# EAGLE design RxPCB_V1-1 (EAGLE 9.6.2)
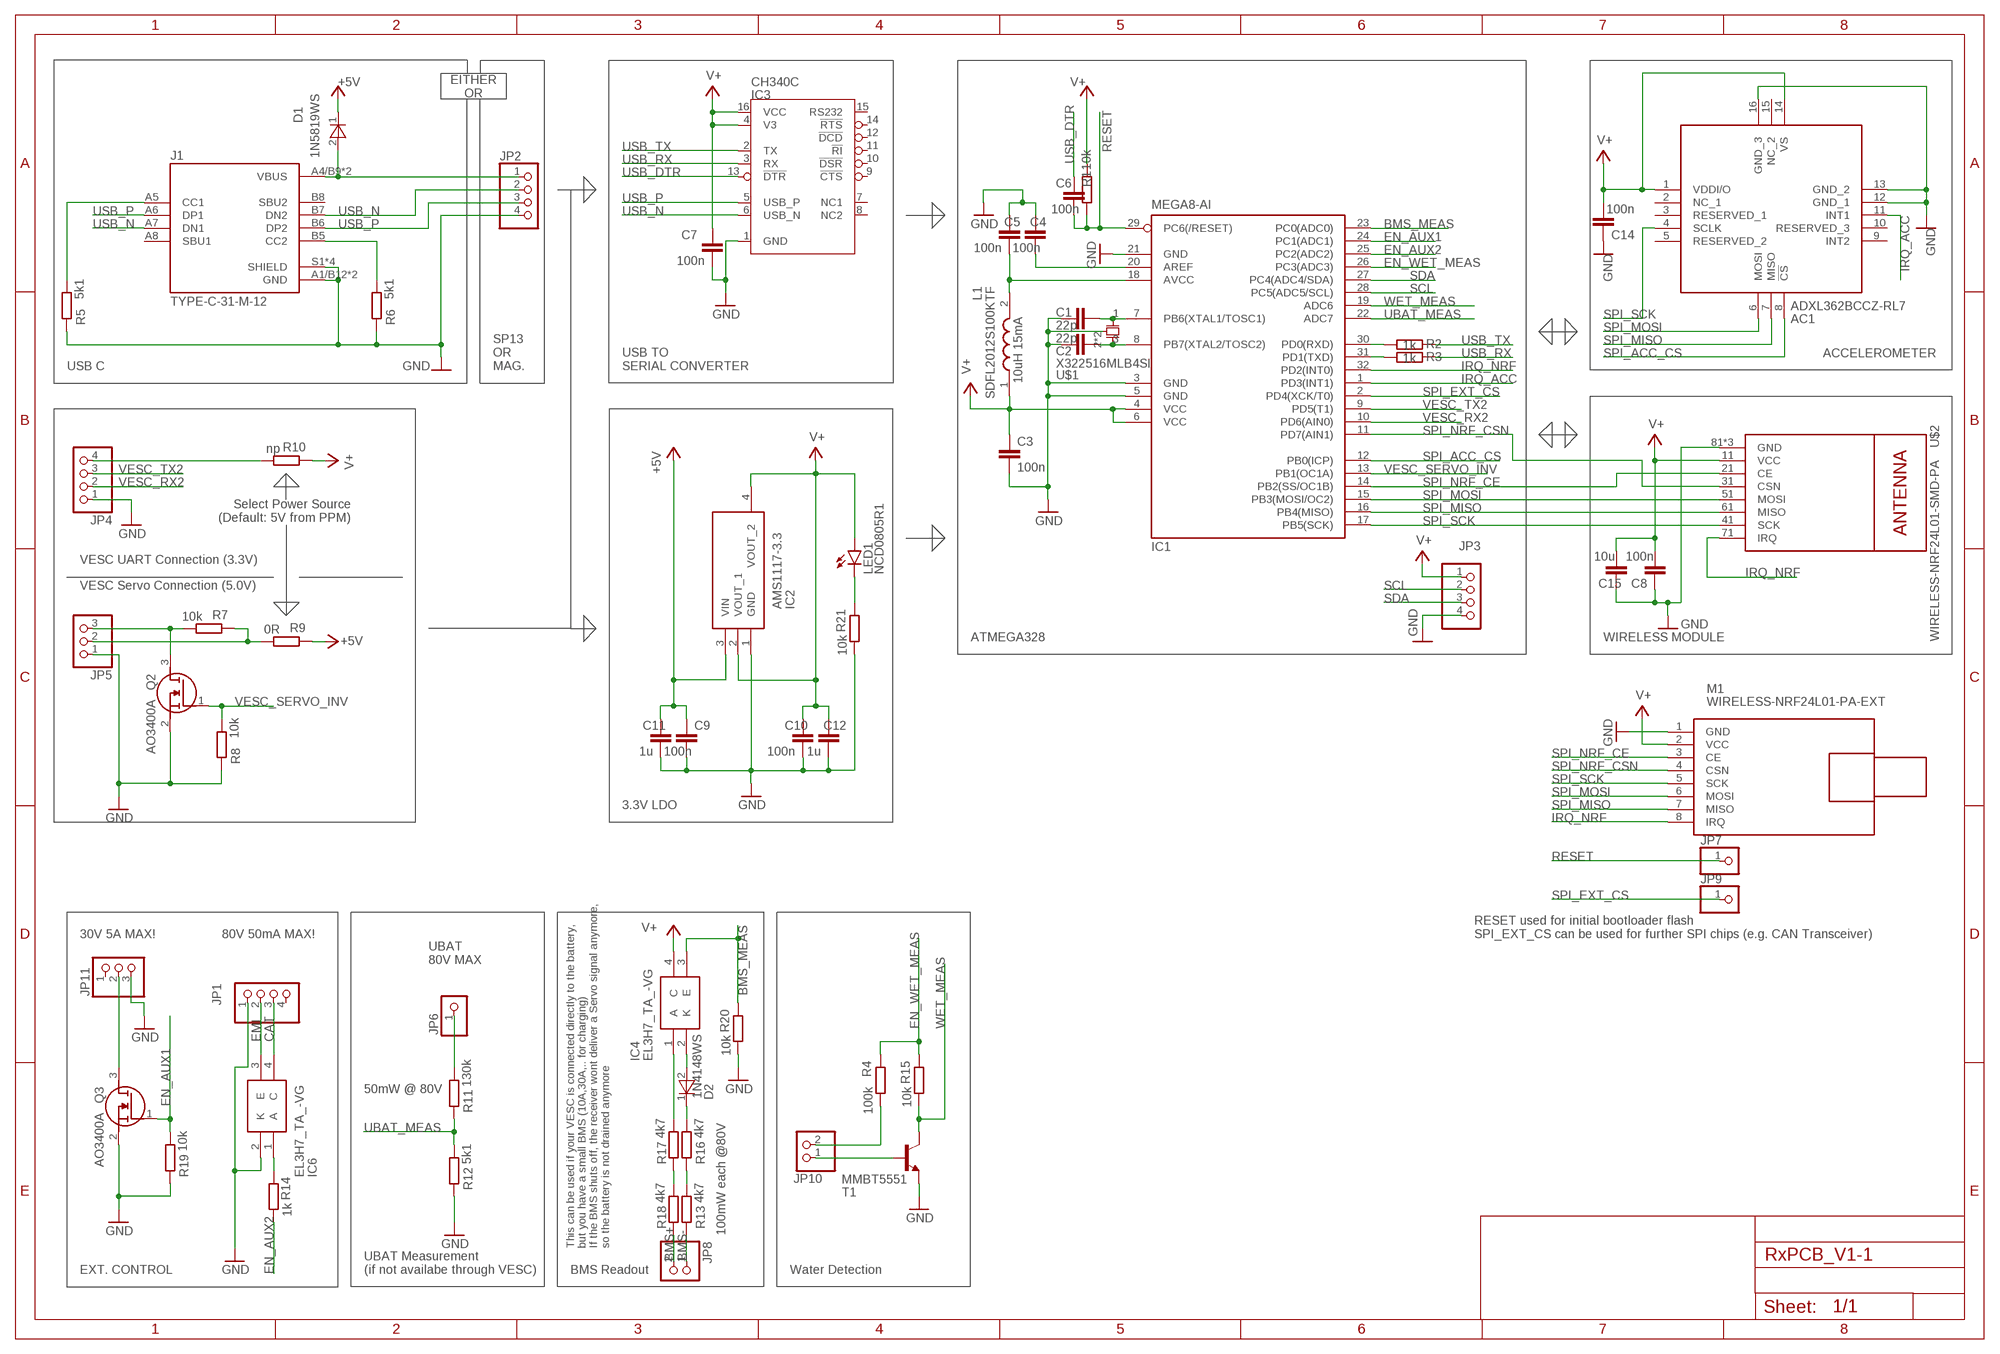
[diagram p0: schematic, sheet 1]

## Parts
AC1  ADXL362BCCZ-RL7  [CC-16-4]
C1  22p  C-EUC0603  [C0603]
C2  22p  C-EUC0603  [C0603]
C3  100n  C-EUC0603  [C0603]
C4  100n  C-EUC0603  [C0603]
C5  100n  C-EUC0603  [C0603]
C6  100n  C-EUC0603  [C0603]
C7  100n  C-EUC0603  [C0603]
C8  100n  C-EUC0603  [C0603]
C9  100n  C-EUC0603  [C0603]
C10  100n  C-EUC0603  [C0603]
C11  1u  C-EUC0603  [C0603]
C12  1u  C-EUC0603  [C0603]
C14  100n  C-EUC0603  [C0603]
C15  10u  C-EUC0603  [C0603]
D1  1N5819WS  1N4148WS  [SODFL2512X90N]
D2  1N4148WS  [SODFL2512X90N]
IC1  MEGA8-AI  [TQFP32-08]
IC2  AMS1117-3.3  [SOT229P700X180-4N]
IC3  CH340C  CH340G  [SOIC16N]
IC4  EL3H7_TA_-VG  [SOIC127P700X200-4N]
IC6  EL3H7_TA_-VG  [SOIC127P700X200-4N]
J1  TYPE-C-31-M-12  [HRO_TYPE-C-31-M-12]
JP1  PINHD-1X4  [1X04]
JP2  PINHD-1X4  [1X04]
JP3  PINHD-1X4  [1X04]
JP4  PINHD-1X4  [1X04]
JP5  PINHD-1X3  [1X03]
JP6  PINHD-1X1  [1X01]
JP7  PINHD-1X1  [1X01]
JP8  PINHD-1X2  [1X02]
JP9  PINHD-1X1  [1X01]
JP10  PINHD-1X2  [1X02]
JP11  PINHD-1X3  [1X03]
L1  SDFL2012S100KTF  SDFL2012Q2R7KTF  [INDC2112X105N]
LED1  NCD0805R1  LEDCHIP-LED0805  [CHIP-LED0805]
M1  WIRELESS-NRF24L01-PA-EXT  [WIRELESS-NRF24L01-PA-EXT]
Q2  AO3400A  [SOT95P280X125-3N]
Q3  AO3400A  [SOT95P280X125-3N]
R1  10k  R-EU_R0603  [R0603]
R2  1k  R-EU_R0603  [R0603]
R3  1k  R-EU_R0603  [R0603]
R4  100k  R-EU_R0603  [R0603]
R5  5k1  R-EU_R0603  [R0603]
R6  5k1  R-EU_R0603  [R0603]
R7  10k  R-EU_R0603  [R0603]
R8  10k  R-EU_R0603  [R0603]
R9  0R  R-EU_R0603  [R0603]
R10  np  R-EU_R0603  [R0603]
R11  130k  R-EU_R0603  [R0603]
R12  5k1  R-EU_R0603  [R0603]
R13  4k7  R-EU_R0603  [R0603]
R14  1k  R-EU_R0603  [R0603]
R15  10k  R-EU_R0603  [R0603]
R16  4k7  R-EU_R0603  [R0603]
R17  4k7  R-EU_R0603  [R0603]
R18  4k7  R-EU_R0603  [R0603]
R19  10k  R-EU_R0603  [R0603]
R20  10k  R-EU_R0603  [R0603]
R21  10k  R-EU_R0603  [R0603]
T1  MMBT5551  BC847B-NPN-SOT23-BEC  [SOT23-BEC]
U$1  X322516MLB4SI  X322516_BETTER  [X322516MLB4SI]
U$2  WIRELESS-NRF24L01-SMD-PA  [WIRELESS-NRF24L01_SMD_PA]

## Nets
+5V: C9.1 C11.1 D1.1(K) IC2.3(VIN) R9.1
BMS+: JP8.2 R18.1
BMS-: JP8.1 R13.1
BMS_MEAS: IC1.23(PC0(ADC0)) IC4.3(E) R20.1
CAT: IC6.4(C) JP1.3
EMI: IC6.3(E) JP1.2
EN_AUX1: IC1.24(PC1(ADC1)) Q3.1(G) R19.2
EN_AUX2: IC1.25(PC2(ADC2)) R14.2
EN_WET_MEAS: IC1.26(PC3(ADC3)) R4.1 R15.1
GND: AC1.12(GND_1) AC1.13(GND_2) AC1.16(GND_3) C1.2 C2.2 C3.2 C4.1 C5.1 C7.2 C8.1 C9.2 C10.2 C11.2 C12.2 C14.1 C15.2 IC1.3(GND) IC1.5(GND) IC1.21(GND) IC2.1(GND) IC3.1(GND) IC6.2(K) J1.A1/B12(GND) J1.B1/A12(GND) J1.S1(SHIELD) J1.S2(SHIELD) J1.S3(SHIELD) J1.S4(SHIELD) JP1.1 JP2.4 JP3.4 JP4.1 JP5.1 JP11.3 M1.1(GND) Q2.2(S) Q3.2(S) R5.1 R6.1 R8.1 R12.1 R19.1 R20.2 R21.2 T1.E U$1.2(G) U$1.4(G) U$2.81(GND) U$2.P1(GND) U$2.P2(GND)
IRQ_ACC: AC1.11(INT1) IC1.1(PD3(INT1))
IRQ_NRF: IC1.32(PD2(INT0)) M1.8(IRQ) U$2.71(IRQ)
N$1: C1.1 IC1.7(PB6(XTAL1/TOSC1)) U$1.1(X1)
N$2: C2.1 IC1.8(PB7(XTAL2/TOSC2)) U$1.3(X2)
N$3: C5.2 IC1.18(AVCC) L1.2
N$4: J1.A5(CC1) R5.2
N$5: IC4.1(A) R17.2
N$6: IC1.30(PD0(RXD)) R2.2
N$7: IC1.31(PD1(TXD)) R3.2
N$8: D1.2(A) J1.A4/B9(VBUS) J1.B4/A9(VBUS) JP2.1
N$9: LED1.C R21.1
N$10: J1.B5(CC2) R6.2
N$11: JP10.1 T1.B
N$12: JP4.4 R10.2
N$13: JP5.2 R7.1 R9.2
N$14: D2.1(K) R16.2
N$15: JP6.1 R11.2
N$16: D2.2(A) IC4.2(K)
N$18: JP10.2 R4.2
N$19: IC6.1(A) R14.1
N$21: R13.2 R16.1
N$23: R17.1 R18.2
N$27: C4.2 IC1.20(AREF)
N$34: JP11.2 Q3.3(D)
RESET: C6.2 IC1.29(PC6(/RESET)) JP7.1 R1.1
SCL: IC1.28(PC5(ADC5/SCL)) JP3.2
SDA: IC1.27(PC4(ADC4/SDA)) JP3.3
SPI_ACC_CS: AC1.8(!CS) IC1.12(PB0(ICP))
SPI_EXT_CS: IC1.2(PD4(XCK/T0)) JP9.1
SPI_MISO: AC1.7(MISO) IC1.16(PB4(MISO)) M1.7(MISO) U$2.61(MISO)
SPI_MOSI: AC1.6(MOSI) IC1.15(PB3(MOSI/OC2)) M1.6(MOSI) U$2.51(MOSI)
SPI_NRF_CE: IC1.14(PB2(SS/OC1B)) M1.3(CE) U$2.21(CE)
SPI_NRF_CSN: IC1.11(PD7(AIN1)) M1.4(CSN) U$2.31(CSN)
SPI_SCK: AC1.4(SCLK) IC1.17(PB5(SCK)) M1.5(SCK) U$2.41(SCK)
UBAT_MEAS: IC1.22(ADC7) R11.1 R12.2
USB_DTR: C6.1 IC3.13(!DTR)
USB_N: IC3.6(USB_N) J1.A7(DN1) J1.B7(DN2) JP2.2
USB_P: IC3.5(USB_P) J1.A6(DP1) J1.B6(DP2) JP2.3
USB_RX: IC3.3(RX) R3.1
USB_TX: IC3.2(TX) R2.1
V+: AC1.1(VDDI/O) AC1.14(VS) C3.1 C7.1 C8.2 C10.1 C12.1 C14.2 C15.1 IC1.4(VCC) IC1.6(VCC) IC2.2(VOUT_1) IC2.4(VOUT_2) IC3.4(V3) IC3.16(VCC) IC4.4(C) JP3.1 L1.1 LED1.A M1.2(VCC) R1.2 R10.1 U$2.11(VCC)
VESC_RX2: IC1.10(PD6(AIN0)) JP4.2
VESC_SERVO_5V: JP5.3 Q2.3(D) R7.2
VESC_SERVO_INV: IC1.13(PB1(OC1A)) Q2.1(G) R8.2
VESC_TX2: IC1.9(PD5(T1)) JP4.3
WET_MEAS: IC1.19(ADC6) R15.2 T1.C
Unconnected: AC1.2(NC_1) AC1.3(RESERVED_1) AC1.5(RESERVED_2) AC1.9(INT2) AC1.10(RESERVED_3) AC1.15(NC_2) IC3.7(NC1) IC3.8(NC2) IC3.9(!CTS) IC3.10(!DSR) IC3.11(!RI) IC3.12(!DCD) IC3.14(!RTS) IC3.15(RS232) J1.A8(SBU1) J1.B8(SBU2) JP1.4 JP11.1

## Notes on the sheet
- EITHER
  OR
- ACCELEROMETER
- USB C
- SP13
  OR
  MAG.
- USB TO
  SERIAL CONVERTER
- 10uH 15mA
- Select Power Source
  (Default: 5V from PPM)
- VESC UART Connection (3.3V)
- VESC Servo Connection (5.0V)
- ATMEGA328 | WIRELESS MODULE
- 3.3V LDO
- 30V 5A MAX! | 80V 50mA MAX!
- RESET used for initial bootloader flash
  SPI_EXT_CS can be used for further SPI chips (e.g. CAN Transceiver)
- UBAT
  80V MAX
- 50mW @ 80V
- 100mW each @80V
- This can be used if your VESC is connected directly to the battery,
  but you have a small BMS (10A,30A,.. for charging)
  If the BMS shuts off, the receiver wont deliver a Servo signal anymore,
  so the battery is not drained anymore
- EXT. CONTROL
- UBAT Measurement
  (if not availabe through VESC)
- BMS Readout | Water Detection

## Library data of the parts
AC1 = ADXL362BCCZ-RL7:ADXL362BCCZ-RL7: Accelerometers Micropower 3-Axis Digital Output MEMS Source: Datasheet <http://www.analog.com/media/en/technical-documentation/data-sheets/ADXL362.pdf>; ARROW_PART_NUMBER: ADXL362BCCZ-RL7; ARROW_PRICE-STOCK: https://www.arrow.com/en/products/adxl362bccz-rl7/analog-devices?region=nac; DESCRIPTION: Accelerometers Micropower 3-Axis Digital Output MEMS; HEIGHT: mm; MANUFACTURER_NAME: Analog Devices; MANUFACTURER_PART_NUMBER: ADXL362BCCZ-RL7; MOUSER_PART_NUMBER: 584-ADXL362BCCZ-R7; MOUSER_PRICE-STOCK: https://www.mouser.co.uk/ProductDetail/Analog-Devices/ADXL362BCCZ-RL7?qs=WIvQP4zGanhCOhEEyirq5Q%3D%3D
C1-C12 C14 C15 = rcl:C-EU: CAPACITOR, European symbol; SPICEPREFIX: C
D1 D2 = 1N4148WS:1N4148WS: ON Semiconductor Switching Diode, 300mA 75V, 2-Pin SOD-323 1N4148WS Source: Datasheet; ARROW_PART_NUMBER: 1N4148WS; ARROW_PRICE-STOCK: https://www.arrow.com/en/products/1n4148ws/on-semiconductor?region=nac; DESCRIPTION: ON Semiconductor Switching Diode, 300mA 75V, 2-Pin SOD-323 1N4148WS; HEIGHT: 0.9mm; MANUFACTURER_NAME: onsemi; MANUFACTURER_PART_NUMBER: 1N4148WS; MOUSER_PART_NUMBER: 512-1N4148WS; MOUSER_PRICE-STOCK: https://www.mouser.co.uk/ProductDetail/ON-Semiconductor-Fairchild/1N4148WS?qs=2%2FYqgE%252BHg%252BKBrKZlAsMLhw%3D%3D
IC1 = atmel:MEGA8: MICROCONTROLLER 8 Kbytes FLASH, 1 kbytes SRAM, 512 bytes EEPROM, USART, 6-channel 10 bit ADC, 2-channel 8 bit ADC Pin compatible with Atmega48, ATMega88, ATMega168 Source: avr.lbr; MPN: ATMEGA8-16AU; OC_FARNELL: 9171371; OC_NEWARK: 73M8863
IC2 = AMS1117-3.3:AMS1117-3.3: 1A LOW DROPOUT VOLTAGE REGULATOR, SOT-223 Source: Datasheet <http://www.advanced-monolithic.com/pdf/ds1117.pdf>; DESCRIPTION: 1A LOW DROPOUT VOLTAGE REGULATOR, SOT-223; HEIGHT: 1.8mm; MANUFACTURER_NAME: Advanced Monolithic Systems; MANUFACTURER_PART_NUMBER: AMS1117-3.3
IC3 = CH340:CH340G
IC4 IC6 = EL3H7_TA_-VG:EL3H7_TA_-VG: Transistor Output Optocouplers 50-600CTR 3750Vrms -55 to +110 Op Temp Source: Datasheet <https://everlightamericas.com/index.php?controller=attachment&id_attachment=2584>; ARROW_PART_NUMBER: EL3H7(TA)-VG; ARROW_PRICE-STOCK: https://www.arrow.com/en/products/el3h7-ta-vg/everlight-electronics?region=nac; DESCRIPTION: Transistor Output Optocouplers 50-600CTR 3750Vrms -55 to +110 Op Temp; HEIGHT: 2mm; MANUFACTURER_NAME: Everlight; MANUFACTURER_PART_NUMBER: EL3H7(TA)-VG; MOUSER_PART_NUMBER: 638-EL3H7TAVG; MOUSER_PRICE-STOCK: https://www.mouser.co.uk/ProductDetail/Everlight/EL3H7TA-VG?qs=8PzhAHr7IdOgYIKe3kw%2F8Q%3D%3D
J1 = TYPE-C-31-M-12:TYPE-C-31-M-12: Check availability <https://pricing.snapeda.com/parts/TYPE-C-31-M-12/HRO%20Electronics%20Co.%2C%20Ltd./view-part?ref=eda>; AVAILABILITY: Not in stock; DESCRIPTION: USB Connectors 24 Receptacle 1 8.94*7.3mm RoHS; MF: HRO Electronics Co., Ltd.; MP: TYPE-C-31-M-12; PACKAGE: Package; PRICE: None
JP1-JP4 = pinhead:PINHD-1X4: PIN HEADER
JP5 JP11 = pinhead:PINHD-1X3: PIN HEADER
JP6 JP7 JP9 = pinhead:PINHD-1X1: PIN HEADER
JP8 JP10 = pinhead:PINHD-1X2: PIN HEADER
L1 = SDFL2012Q2R7KTF:SDFL2012Q2R7KTF: Multi-layer Chip Ferrite Inductor Source: Datasheet <https://datasheet.lcsc.com/szlcsc/Sunlord-SDFL2012Q2R7KTF_C74318.pdf>; DESCRIPTION: Multi-layer Chip Ferrite Inductor; HEIGHT: 1.05mm; MANUFACTURER_NAME: SUNLORD; MANUFACTURER_PART_NUMBER: SDFL2012Q2R7KTF
LED1 = led:LED: LED OSRAM: - CHIPLED LG R971, LG N971, LY N971, LG Q971, LY Q971, LO R971, LY R971 LH N974, LH R974 LS Q976, LO Q976, LY Q976 LO Q996 - Hyper CHIPLED LW Q18S LB Q993, LB Q99A, LB R99A - SideLED LS A670, LO A670, LY A670, LG A670, LP A670 LB A673, LV A673, LT A673, LW A673 LH A674 LY A675 LS A676, LA A676, LO A676, LY A676, LW A676 LS A679, LY A679, LG A679 - Hyper Micro SIDELED® LS Y876, LA Y876, LO Y876, LY Y876 LT Y87S - SmartLED LW L88C, LW L88S LB L89C, LB L89S, LG L890 LS L89K, LO L89K, LY L89K LS L896, LA L896, LO L896, LY L896 - TOPLED LS T670, LO T670, LY T670, LG T670, LP T670 LSG T670, LSP T670, LSY T670, LOP T670, LYG T670 LG T671, LOG T671, LSG T671 LB T673, LV T673, LT T673, LW T673 LH T674 LS T676, LA T676, LO T676, LY T676, LB T676, LH T676, LSB T676, LW T676 LB T67C, LV T67C, LT T67C, LS T67K, LO T67K, LY T67K, LW E67C LS E67B, LA E67B, LO E67B, LY E67B, LB E67C, LV E67C, LT E67C LW T67C LS T679, LY T679, LG T679 LS T770, LO T770, LY T770, LG T770, LP T770 LB T773, LV T773, LT T773, LW T773 LH T774 LS E675, LA E675, LY E675, LS T675 LS T776, LA T776, LO T776, LY T776, LB T776 LHGB T686 LT T68C, LB T68C - Hyper Mini TOPLED® LB M676 - Mini TOPLED Santana® LG M470 LS M47K, LO M47K, LY M47K Source: http://www.osram.convergy.de LUXEON: - LUMILED® LXK2-PW12-R00, LXK2-PW12-S00, LXK2-PW14-U00, LXK2-PW14-V00 LXK2-PM12-R00, LXK2-PM12-S00, LXK2-PM14-U00 LXK2-PE12-Q00, LXK2-PE12-R00, LXK2-PE12-S00, LXK2-PE14-T00, LXK2-PE14-U00 LXK2-PB12-K00, LXK2-PB12-L00, LXK2-PB12-M00, LXK2-PB14-N00, LXK2-PB14-P00, LXK2-PB14-Q00 LXK2-PR12-L00, LXK2-PR12-M00, LXK2-PR14-Q00, LXK2-PR14-R00 LXK2-PD12-Q00, LXK2-PD12-R00, LXK2-PD12-S00 LXK2-PH12-R00, LXK2-PH12-S00 LXK2-PL12-P00, LXK2-PL12-Q00, LXK2-PL12-R00 Source: www.luxeon.com KINGBRIGHT: KA-3528ASYC Source: www.kingbright.com
M1 = diy-modules:WIRELESS-NRF24L01-PA-EXT: 2.4 GHz Wireless Module based on NRF24L01 chip with preamplifier and external antenna Click here to find device on ebay.com <http://www.ebay.com/sch/nrf24l01+pa+lna+sma>
Q2 Q3 = AO3400A:AO3400A: 30V N-Channel MOSFET Source: Datasheet <http://aosmd.com/res/data_sheets/AO3400A.pdf>; ARROW_PART_NUMBER: AO3400A; ARROW_PRICE-STOCK: https://www.arrow.com/en/products/ao3400a/alpha-and-omega-semiconductor?region=nac; DESCRIPTION: 30V N-Channel MOSFET; HEIGHT: 1.25mm; MANUFACTURER_NAME: Alpha & Omega Semiconductors; MANUFACTURER_PART_NUMBER: AO3400A
R1-R21 = rcl:R-EU_: RESISTOR, European symbol; SPICEPREFIX: R
T1 = transistor:*-NPN-: NPN Transistror BF959 corrected 2008.03.06
U$1 = X322516MLB4SI:X322516_BETTER
U$2 = diy-modules:WIRELESS-NRF24L01-SMD-PA

## Board
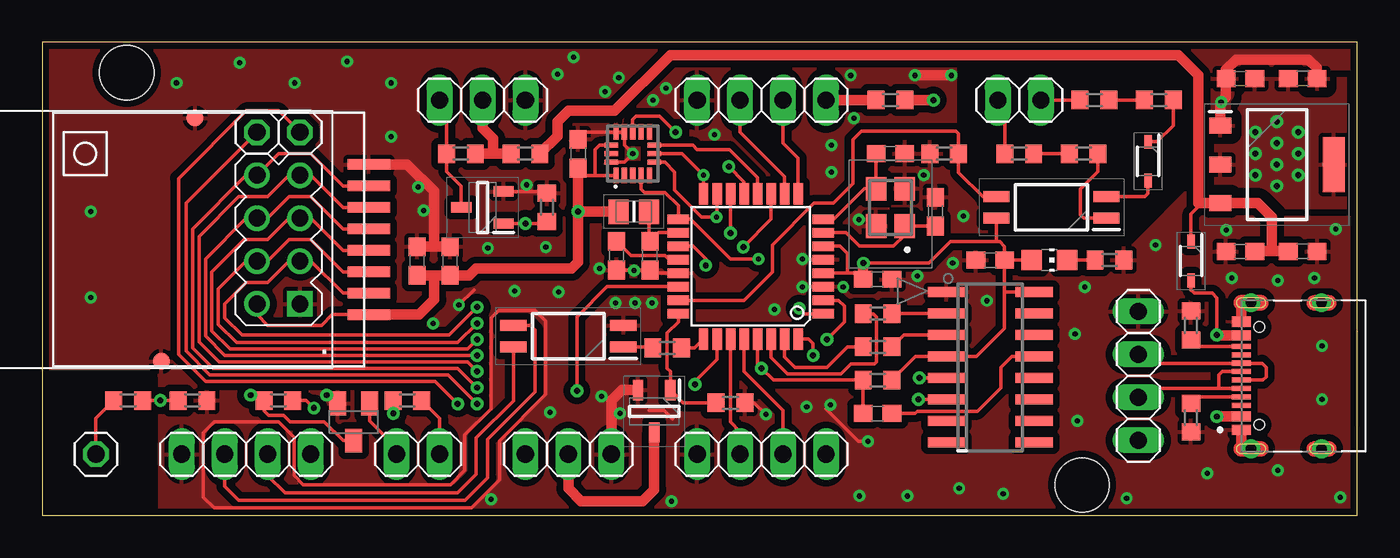
[diagram p1: board, top side]
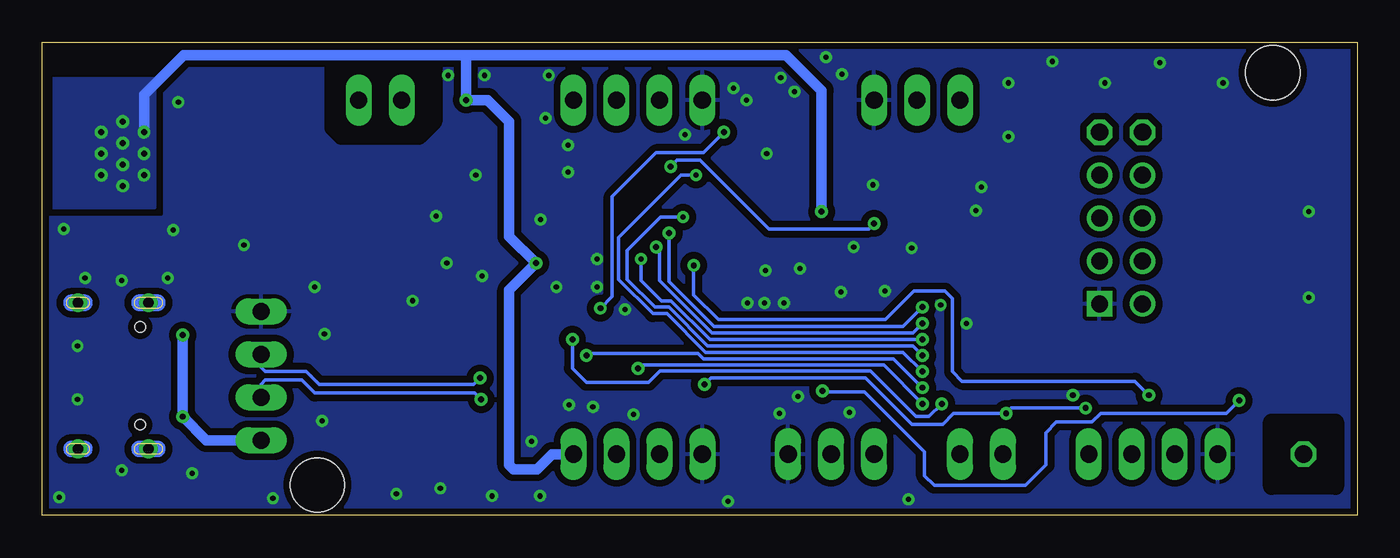
[diagram p2: board, bottom side, seen from below]

Size 77.78 x 28 mm. Coordinates in mm from the lower left corner, seen from the top.
Outline: 0,0 77.78,0 77.78,28 0,28 0,0
Copper layers (1*16): Top 0.035mm / dielectric 1.5mm / Bottom 0.035mm
Design rules "jlcpcb": minimum track width 3.5mil, minimum drill 0.2mm, track to track 3.5mil, track to pad 5mil, pad to pad 5mil, via to via 5mil, smd to smd 5mil, copper to edge 0.2mm, drill to drill 8mil, minimum pad ring 10mil, minimum via ring 8mil, stop-mask expansion 4mil, vias tented up to drill 0mil, thermal gap 10mil
Holes 3.2 mm at 5,26.2 61.5,1.8
tRestrict: area 54.6,16.4 to 67.9,26.8; area 0,-0.2 to 6.3,8.1
bRestrict: area 1.3,1.7 to 5.1,5.5; area 54.6,22.4 to 60.6,26.8

### Footprints (pad centres in the part's own frame; a part is rotated, then mirrored left to right if it is on the bottom)
CC-16-4 = smd 0.925 x 0.3: 1 -1.288,1; 2 -1.288,0.5; 3 -1.288,0; 4 -1.288,-0.5; 5 -1.288,-1; 9 1.288,-1; 10 1.288,-0.5; 11 1.288,0; 12 1.288,0.5; 13 1.288,1 | smd 0.3 x 0.8: 6 -0.5,-1.275; 7 0,-1.275; 8 0.5,-1.275; 14 0.5,1.275; 15 0,1.275; 16 -0.5,1.275
C0603 = smd 1.1 x 1: 1 -0.85,0; 2 0.85,0
SODFL2512X90N = smd 0.82 x 0.42: 1 -1.15,0; 2 1.15,0
TQFP32-08 = smd 1.27 x 0.559: 1 -4.293,2.8; 2 -4.293,2; 3 -4.293,1.2; 4 -4.293,0.4; 5 -4.293,-0.4; 6 -4.293,-1.2; 7 -4.293,-2; 8 -4.293,-2.8; 17 4.293,-2.8; 18 4.293,-2; 19 4.293,-1.2; 20 4.293,-0.4; 21 4.293,0.4; 22 4.293,1.2; 23 4.293,2; 24 4.293,2.8 | smd 0.559 x 1.27: 9 -2.8,-4.293; 10 -2,-4.293; 11 -1.2,-4.293; 12 -0.4,-4.293; 13 0.4,-4.293; 14 1.2,-4.293; 15 2,-4.293; 16 2.8,-4.293; 25 2.8,4.293; 26 2,4.293; 27 1.2,4.293; 28 0.4,4.293; 29 -0.4,4.293; 30 -1.2,4.293; 31 -2,4.293; 32 -2.8,4.293
SOT229P700X180-4N = smd 1.3 x 0.95: 1 -3.35,2.29; 2 -3.35,0; 3 -3.35,-2.29 | smd 1.3 x 3.25: 4 3.35,0
SOIC16N = smd 2.2 x 0.6: 1 -2.6,4.445; 2 -2.6,3.175; 3 -2.6,1.905; 4 -2.6,0.635; 5 -2.6,-0.635; 6 -2.6,-1.905; 7 -2.6,-3.175; 8 -2.6,-4.445; 9 2.6,-4.445; 10 2.6,-3.175; 11 2.6,-1.905; 12 2.6,-0.635; 13 2.6,0.635; 14 2.6,1.905; 15 2.6,3.175; 16 2.6,4.445
SOIC127P700X200-4N = smd 1.55 x 0.65: 1 -3.25,0.635; 2 -3.25,-0.635; 3 3.25,-0.635; 4 3.25,0.635
HRO_TYPE-C-31-M-12 = smd 0.6 x 1.14: A1/B12 -3.2,4.75; A4/B9 -2.4,4.75; B1/A12 3.2,4.75; B4/A9 2.4,4.75 | smd 0.3 x 1.14: A5 -1.25,4.75; A6 -0.25,4.75; A7 0.25,4.75; A8 1.25,4.75; B5 1.75,4.75; B6 0.75,4.75; B7 -0.75,4.75; B8 -1.75,4.75 | drill 0.6 pad 0.9: S1 -4.325,4.17; S2 4.325,4.17; S3 -4.325,0; S4 4.325,0 | hole 0.6: -2.89,3.68; 2.89,3.68
1X04 = drill 1.016 long: 1 -3.81,0; 2 -1.27,0; 3 1.27,0; 4 3.81,0
1X03 = drill 1.016 long: 1 -2.54,0; 2 0,0; 3 2.54,0
1X01 = drill 1.016 octagon: 1 0,0
1X02 = drill 1.016 long: 1 -1.27,0; 2 1.27,0
INDC2112X105N = smd 1.2 x 1.45: 1 -0.9,0; 2 0.9,0
CHIP-LED0805 = smd 1.2 x 1.2: A 0,-1.05; C 0,1.05
WIRELESS-NRF24L01-PA-EXT = drill 1 square: 1 -18.415,3.81 | drill 1: 2 -15.875,3.81; 3 -18.415,1.27; 4 -15.875,1.27; 5 -18.415,-1.27; 6 -15.875,-1.27; 7 -18.415,-3.81; 8 -15.875,-3.81
SOT95P280X125-3N = smd 1.2 x 0.6: 1 -1.25,0.95; 2 -1.25,-0.95; 3 1.25,0
R0603 = smd 1 x 1.1: 1 -0.85,0; 2 0.85,0
SOT23-BEC = smd 1 x 1.4: B -0.95,-1.1; C 0,1.1; E 0.95,-1.1
X322516MLB4SI = smd 1.4 x 1.2: 1 -1.1,-0.85; 2 1.1,-0.85; 3 1.1,0.85; 4 -1.1,0.85
WIRELESS-NRF24L01_SMD_PA = smd 2.5 x 0.635: 11 -9.153,4.445; 21 -9.153,3.175; 31 -9.153,1.905; 41 -9.153,0.635; 51 -9.153,-0.635; 61 -9.153,-1.905; 71 -9.153,-3.175; 81 -9.153,-4.445 | smd 1 x 1: P1 3.117,7.2; P2 1.117,-7.2

### Placement (x,y rotation side)
AC1  34.92,21.4 90 top
C1  52.83,17.97 90 top
C2  50.16,21.4 0 top
C3  49.4,13.97 0 top
C4  33.97,15.37 90 top
C5  35.94,15.37 90 top
C6  49.4,6.03 180 top
C7  56.07,15.11 180 top
C8  22.16,15.05 270 top
C9  70.87,15.62 180 top
C10  74.55,25.84 0 top
C11  74.55,15.62 0 top
C12  70.87,25.84 180 top
C14  31.69,21.4 270 top
C15  24.13,15.05 90 top
D1  67.94,15.05 270 top
D2  65.41,20.95 270 top
IC1  41.91,14.73 180 top
IC2  73.03,20.76 0 top
IC3  56.07,8.76 0 top
IC4  59.69,18.22 180 top
IC6  31.11,10.6 180 top
J1  75.67,8.25 90 top
JP1  12.06,3.62 0 top
JP2  64.83,8.25 90 top
JP3  42.55,3.62 180 top
JP4  42.55,24.57 0 top
JP5  26.04,24.57 180 top
JP6  3.17,3.62 90 top
JP7  12.7,22.67 90 top
JP8  57.78,24.57 180 top
JP9  15.24,22.67 90 top
JP10  22.23,3.62 0 top
JP11  31.11,3.62 0 top
L1  34.99,17.97 0 top
LED1  59.56,15.11 270 top
M1  -3.17,16.32 180 top
Q2  26.04,18.22 180 top
Q3  36.2,6.16 270 top
R1  49.4,8 0 top
R2  49.4,11.94 180 top
R3  49.4,9.97 180 top
R4  21.59,6.79 0 top
R5  67.94,5.78 90 top
R6  67.94,11.24 270 top
R7  24.77,21.4 180 top
R8  29.84,18.22 270 top
R9  28.57,21.4 180 top
R10  50.16,24.57 180 top
R11  5.08,6.79 180 top
R12  8.89,6.79 180 top
R13  62.23,24.57 0 top
R14  36.96,9.91 0 top
R15  13.97,6.79 180 top
R16  66.04,24.57 0 top
R17  61.59,21.4 0 top
R18  57.78,21.4 0 top
R19  40.7,6.67 180 top
R20  53.34,21.4 180 top
R21  63.12,15.11 0 top
T1  18.41,5.52 180 top
U$1  50.16,18.22 90 top
U$2  10.16,16.32 180 top

### Tracks (layer width: path | path; a pad name or v marks a point on that pad's centre or on a via)
+5V
  Top 0.2: D1.1 67.94,17.84 68.58,18.47
  Top 0.61: C11.1 73.72,15.65 72.71,15.65 | C9.1 71.74,15.65 72.71,15.65 | 72.71,15.65 72.71,17.65 71.89,18.47 IC2.3 68.58,18.47 68.39,18.47 68.39,26.04 67.18,27.24 37.15,27.24 33.85,23.94 31.11,23.94 30.48,23.3 30.48,22.45 R9.1
BMS+
  Top 0.2: JP8.2 56.94,24.15 R18.1
BMS-
  Top 0.2: JP8.1 R13.1
BMS_MEAS
  Top 0.2: IC4.3 55.63,18.86 54.19,20.3 R20.1 54.19,22.58 54.04,22.73 48.45,22.73 47.94,22.23 47.94,19.62 46.8,18.48 45.66,18.48 43.18,16 43.18,14.41 41.49,12.73 IC1.23
CAT
  Top 0.2: IC6.4 27.86,6.78 25.65,4.57 25.65,2.41 24.57,1.33 14.35,1.33 13.34,2.35 JP1.3
EMI
  Top 0.2: JP1.2 10.79,1.72 11.62,0.89 25.02,0.89 26.35,2.22 26.35,4.51 29.15,7.3 29.15,10.99 28.89,11.24 IC6.3
EN_AUX1
  Top 0.2: R19.2 37.89,6.67 Q3.1 37.15,8.51 36.96,8.7 36.96,10.79 37.62,11.46 IC1.24
EN_AUX2
  Top 0.2: R14.2 38.58,9.91 IC1.25
EN_WET_MEAS  (via drill 0.35)
  Top 0.2: v20.77,6.03 20.74,6.06 R4.1 | R15.1 15.62,6.79 v16.07,6.35 | v38.61,7.75 38.61,7.94 39.91,9.24 IC1.26
  Bottom 0.2: v38.61,7.75 38.23,8.12 29.08,8.12 26.35,5.4 24.51,5.4 23.88,6.03 v20.77,6.03 20.45,6.35 v16.07,6.35
GND  (via drill 0.3 pad 0.4, 0.35)
  Top 0.2: 51.52,18.82 U$1.2 | C4.1 C5.1 36.13,14.33 IC1.21 | AC1.16 34.42,20.9 v34.92,21.4 34.42,21.9 AC1.12 AC1.13 32.12,22.69 C14.1 | Q2.2 28.57,19.17 | 28.57,19.17 28.57,19.18 | R8.1 29.75,19.17 28.57,19.17 | T1.E 17.32,6.62 v16.83,7.11 | 35.88,6.22 36.77,6.22 37.27,5.71 | v48.83,4.38 48.26,4.38 46.35,6.29 | R19.1 42.1,6.67 v42.8,5.97 | v24.64,12.45 25.53,13.33 | 24.98,2.66 24.98,4.75 26.54,6.31 26.54,11.68 26.99,12.13 29.15,12.13 29.78,11.49 29.78,7.15 27.05,4.42 27.05,2.1 25.4,0.45 10.16,0.45 9.53,1.08 9.53,4.89 10.16,5.52 13.97,5.52 14.89,4.61 14.89,2.36 15.43,1.81 24.14,1.81 24.98,2.66
  Top 0.61: C8.1 23.18,15.9 | 23.18,15.9 C15.2 | U$2.81 21.59,20.76 23.18,19.18 23.18,15.9 | C10.2 75.37,25.87 75.37,26.48 74.88,26.97 70.61,26.97 70.02,26.38 C12.2 70.02,24.74 v69.72,24.45 69.67,24.4 IC2.1 | JP11.3 33.66,6.79 34.29,7.43 35.23,7.43 Q3.2 | J1.B1/A12 70.92,12.58 J1.S2 | J1.A1/B12 70.92,3.93 J1.S1 | v51.63,26.04 v53.78,26.04
  other vias: 48.3,17.51 52.13,20.13 55.88,12.7 53.85,14.92 34.99,14.48 51.75,14.16 32.96,14.61 47.37,13.53 22.54,18.03 22.23,19.43 70.04,16.89 76.52,16.95 28.64,19.56 36.89,25.27 39.75,22.54 33.91,12.57 35.05,12.57 36.07,12.57 33.08,7.05 34.16,6.03 37.21,0.83 48.32,1.14 51.18,1.14 54.23,1.59 46.61,6.54 45.21,6.41 23.11,11.37 27.94,13.27 30.54,13.21 30.04,6.1 26.35,15.81 29.78,15.88 61.21,5.59 61.09,10.73 61.66,13.53 70.36,14.03 75.25,14.03 73.09,13.91 76.77,1.08 73.09,2.67 68.9,2.48 64.14,1.02 44.96,13.53 44.96,15.18 20.64,22.42 20.64,25.59 14.92,25.59 7.94,25.59 2.86,17.97 2.86,12.89 26.54,0.95 56.83,1.27 65.85,16 47.82,26.04 54.48,17.72 48.01,23.5 46.67,21.91 46.67,20.32 34.1,25.91 33.27,25.08 36.13,24.57 31.43,27.11 30.48,26.1 11.68,26.8 18.03,26.86 43.31,12.19 75.69,6.86 75.69,10.03
  pour Top (isolate 0.406, rank 2): 0,28.38 78.11,28.38 78.11,-0.19 0,-0.19
  pour Bottom (isolate 0.406, rank 2): 0,28.38 78.11,28.38 78.11,-0.19 0,-0.19
IRQ_ACC  (via drill 0.35)
  Top 0.2: IC1.1 45.09,11.93 v44.77,12.25 | AC1.11 34.92,23.43 35.12,23.62 36.51,23.62 v37.47,22.67
  Bottom 0.2: v44.77,12.25 44.07,12.95 44.07,18.86 41.47,21.46 38.67,21.46 v37.47,22.67
IRQ_NRF  (via drill 0.35)
  Top 0.2: v25.72,7.56 24.57,8.7 10.11,8.7 8.89,9.91 8.89,16.95 12.06,20.13 M1.8 13.97,21.4 15.88,21.4 17.78,19.49 U$2.71 | v45.59,9.46 45.59,10.16 45.32,10.44 IC1.32
  Bottom 0.2: v25.72,7.56 27.43,9.27 38.67,9.27 38.99,9.59 45.47,9.59 v45.59,9.46
N$1
  Top 0.2: C1.1 U$1.1 51.02,16.6 50.35,15.94 48.32,15.94 47.53,16.73 IC1.7
N$2
  Top 0.2: C2.1 U$1.3 48.62,19.32 46.82,17.53 IC1.8
N$3
  Top 0.2: IC1.18 36.45,16.73 C5.2 35.89,16.27 L1.2
N$4
  Top 0.2: J1.A5 68.32,7 R5.2
N$5
  Top 0.2: R17.2 62.45,20.34 61.4,19.3 61.4,17.78 61.59,17.59 IC4.1
N$6
  Top 0.2: IC1.30 43.11,9.34 44.07,8.38 47.24,8.38 47.82,8.95 49.21,8.95 49.34,9.08 49.34,11.75 49.17,11.91 48.55,11.91 R2.2
N$7
  Top 0.2: IC1.31 43.91,9.37 44.51,8.76 46.42,8.76 47.62,9.97 R3.2
N$8  (via drill 0.35)
  Top 0.2: D1.2 67.94,13.33 68.14,13.14 69.22,13.14 69.48,12.88 69.48,10.65
  Top 0.61: J1.A4/B9 69.46,5.85 v69.47,5.84 | J1.B4/A9 69.48,10.65 v69.47,10.67
  Bottom 0.61: v69.47,10.67 v69.47,5.84 68.07,4.45 JP2.1
N$9
  Top 0.2: LED1.C R21.1
N$10
  Top 0.2: J1.B5 68.33,10 R6.2
N$11
  Top 0.2: T1.B 19.36,5.59 20.95,4 JP10.1
N$12
  Top 0.61: JP4.4 R10.2
N$13
  Top 0.61: R7.1 26.67,21.4 | 26.67,21.4 R9.2 | JP5.2 26.04,22.92 26.67,22.29 26.67,21.4
N$14
  Top 0.2: D2.1 65.92,22.1 66.89,23.07 R16.2
N$15
  Top 0.2: JP6.1 3.17,5.74 R11.2
N$16
  Top 0.2: IC4.2 65.22,18.86 65.41,19.05 D2.2
N$18
  Top 0.2: R4.2 23.5,5.74 JP10.2
N$19
  Top 0.2: IC6.1 36.04,9.97 R14.1
N$21
  Top 0.2: R13.2 R16.1
N$23
  Top 0.2: R18.2 R17.1
N$27
  Top 0.2: C4.2 34.82,15.37 36.83,15.37 37.07,15.13 IC1.20
N$34
  Top 0.61: JP11.2 31.11,1.59 31.88,0.83 35.5,0.83 36.2,1.52 Q3.3
RESET  (via drill 0.35)
  Top 0.2: C6.2 R1.1 43.24,8 v42.55,8.7 42.31,8.94 IC1.29 | JP7.1 8.51,18.48 8.51,9.72 9.91,8.32 24,8.32 v25.72,6.6
  Bottom 0.2: v25.72,6.6 28,8.89 42.35,8.89 v42.55,8.7
SCL
  Top 0.2: IC1.28 41.51,8.53 43.81,6.22 JP3.2
SDA
  Top 0.2: IC1.27 40.71,8.07 40.7,8.06 40.7,5.52 41.27,4.95 JP3.3
SPI_ACC_CS
  Top 0.2: IC1.12 42.31,19.98 40.64,21.65 38.73,21.65 38.49,21.9 AC1.8
SPI_EXT_CS  (via drill 0.35)
  Top 0.2: IC1.2 47.09,12.73 47.43,12.38 47.43,11.43 v46.42,10.41 | JP9.1 13.97,23.94 12.06,23.94 8.06,19.94 8.06,9.53 9.65,7.94 23.24,7.94 v24.57,6.6
  Bottom 0.2: v46.42,10.41 46.42,8.7 45.59,7.87 41.91,7.87 41.25,8.54 28.79,8.54 26.1,5.84 25.34,5.84 v24.57,6.6
SPI_MISO  (via drill 0.3 pad 0.4, 0.35)
  Top 0.2: IC1.16 v39.11,20.14 37.85,21.4 AC1.7 | v25.72,8.51 25.15,9.08 10.45,9.08 9.27,10.26 9.27,16.51 11.62,18.86 13.34,18.86 14.61,20.13 M1.7 15.88,20.13 17.78,18.22 U$2.61
  Bottom 0.2: v39.11,20.14 v39.12,20.13 40.01,20.13 43.69,16.45 43.69,13.97 41.66,11.94 40.83,11.94 38.54,9.65 26.86,9.65 v25.72,8.51
SPI_MOSI  (via drill 0.3 pad 0.4, 0.35)
  Top 0.2: IC1.15 39.91,17.68 v39.88,17.65 38.99,17.65 37.4,19.24 37.4,20.32 36.82,20.9 AC1.6 | v25.72,9.46 10.79,9.46 9.65,10.6 9.65,15.18 12.06,17.59 M1.6 13.34,17.59 14.61,18.86 15.88,18.86 17.78,16.95 U$2.51
  Bottom 0.2: v39.88,17.65 41.21,17.65 43.18,15.69 43.18,13.97 41.53,12.32 40.7,12.32 38.42,10.03 26.29,10.03 v25.72,9.46
SPI_NRF_CE  (via drill 0.35)
  Top 0.2: v25.72,12.32 24.07,10.67 11.81,10.67 10.79,11.68 10.79,12.51 12.06,13.78 13.34,13.78 14.61,15.05 M1.3 15.88,15.05 17.78,13.14 U$2.21 | v40.7,16.7 40.7,19.02 IC1.14
  Bottom 0.2: v25.72,12.32 26.86,11.18 38.04,11.18 40.7,13.84 v40.7,16.7
SPI_NRF_CSN  (via drill 0.35)
  Top 0.2: v25.72,11.37 24.57,10.22 11.49,10.22 10.41,11.3 10.41,13.4 12.06,15.05 M1.4 13.34,15.05 14.61,16.32 15.88,16.32 17.78,14.41 U$2.31 | v41.47,15.88 43.11,17.52 IC1.11
  Bottom 0.2: v25.72,11.37 26.29,10.79 38.16,10.79 41.27,13.91 41.27,15.69 v41.47,15.88
SPI_SCK  (via drill 0.3 pad 0.4, 0.35)
  Top 0.2: v42.35,15.18 40.71,15.18 38.35,17.53 IC1.17 37.62,18.33 36.83,19.11 35.62,19.11 35.42,19.31 AC1.4 | v25.72,10.41 25.15,9.84 11.11,9.84 10.03,10.92 10.03,14.41 11.94,16.32 13.34,16.32 14.61,17.59 M1.5 15.88,17.59 17.78,15.69 U$2.41
  Bottom 0.2: v25.72,10.41 38.29,10.41 40.58,12.7 41.15,12.7 42.35,13.91 v42.35,15.18
UBAT_MEAS  (via drill 0.35)
  Top 0.2: R11.1 v6.99,6.79 R12.2 | v31.62,7.37 31.62,11.75 33.41,13.53 IC1.22
  Bottom 0.2: v6.99,6.79 7.75,6.03 15.18,6.03 15.68,5.52 17.78,5.52 18.41,4.89 18.41,2.98 19.62,1.78 25.02,1.78 25.59,2.35 25.59,3.75 29.15,7.3 31.56,7.3 v31.62,7.37
USB_DTR
  Top 0.2: C6.1 51.63,6.03 51.75,6.16 55.31,6.16 56.71,7.56 56.71,8.76 57.34,9.4 IC3.13
USB_N  (via drill 0.35)
  Top 0.2: J1.A7 69.78,8.5 69.6,8.32 69.6,7.5 | JP2.2 65.35,7.5 69.6,7.5 | 69.6,7.5 J1.B7 | IC3.6 v51.82,6.86
  Bottom 0.2: v51.82,6.86 52.2,7.24 61.66,7.24 62.42,8 64.58,8 64.83,7.75 JP2.2
USB_P  (via drill 0.35)
  Top 0.2: J1.A6 72.2,8 72.39,8.19 72.39,8.76 72.15,9 J1.B6 65.35,9 JP2.3 | IC3.5 v51.88,8.13
  Bottom 0.2: v51.88,8.13 52.26,7.75 61.4,7.75 62.17,8.51 64.58,8.51 64.83,8.76 JP2.3
USB_RX
  Top 0.2: R3.1 50.95,10.67 IC3.3
USB_TX
  Top 0.2: R2.1 IC3.2
V+  (via drill 0.35)
  Top 0.2: AC1.14 32.95,21.9 32.7,21.65 32.7,20.11 AC1.1 32.12,20.11 C14.2 | IC1.4 47.62,14.33 | 47.62,14.33 47.62,15.49 47.19,15.93 IC1.6 | 47.62,14.33 48.19,14.33 C3.1 | M1.2 12.7,11.87 13.34,11.24 16.51,11.24 17.14,11.87 U$2.11 | IC3.16 56.92,13.21 | 56.92,13.21 C7.1 | 56.92,13.21 56.92,11.07 55.24,9.4 IC3.4 51.65,9.4 R1.2 | v48.58,14.92 52.45,14.92 53.72,16.19 56.45,16.19 | 56.45,16.19 56.64,16.19 56.92,15.91 C7.1 | 56.45,16.19 56.44,16.2 IC4.4 | C7.1 LED1.A
  Top 0.61: U$2.11 22.29,11.87 23.18,12.76 23.18,14.2 | 23.18,14.2 C15.1 25.25,14.2 25.65,14.61 31.3,14.61 31.69,14.99 v31.69,17.97 | 23.18,14.2 C8.2 | C14.2 v31.69,17.97 | L1.1 v31.69,17.97 | R10.1 v52.7,24.57 | C3.1 48.55,14.9 v48.58,14.92
  Bottom 0.61: v31.69,17.97 31.69,25.15 33.78,27.24 52.7,27.24 | 52.7,27.24 69.41,27.24 71.75,24.89 v71.75,22.67 | 52.7,27.24 v52.7,24.57 51.44,24.57 50.16,23.3 50.16,16.51 v48.58,14.92 50.16,13.33 50.16,2.98 49.91,2.73 48.51,2.73 47.62,3.62 JP3.1
  other vias: 73.03,22.03 73.03,20.76 73.03,19.49 73.03,23.3 71.75,21.4 71.75,20.13 74.3,20.13 74.3,21.4 74.3,22.67
  pour Top (isolate 0.61): 68.58,18.22 77.47,18.22 77.47,25.84 68.58,25.84
  pour Bottom (isolate 0.61): 71.12,25.84 71.12,18.22 77.47,18.22 77.47,25.84
VESC_RX2
  Top 0.2: JP4.2 41.27,22.67 43.09,20.86 43.18,20.76 43.91,20.04 IC1.10
VESC_SERVO_5V
  Top 0.2: Q2.3 24.79,19.47 23.91,20.34 R7.2 23.91,24.15 JP5.3
VESC_SERVO_INV  (via drill 0.35)
  Top 0.2: Q2.1 v28.57,17.27 29.75,17.27 R8.2 | v40.61,20.64 41.51,19.73 IC1.13
  Bottom 0.2: v40.61,20.64 40.23,21.02 38.86,21.02 34.8,16.95 28.89,16.95 v28.57,17.27
VESC_TX2
  Top 0.2: JP4.3 43.81,22.04 44.71,21.14 IC1.9
WET_MEAS  (via drill 0.35)
  Top 0.2: T1.C 17.78,4.42 16.68,5.52 14.67,5.52 14.29,5.91 13.4,5.91 13.12,6.18 R15.2 12.8,7.11 v12.32,7.11 | IC1.19 38.49,15.93 39.24,15.18 v39.24,14.8
  Bottom 0.2: v39.24,14.8 39.24,13.04 37.79,11.59 27.91,11.59 26.23,13.27 24.38,13.27 23.94,12.83 23.94,8.51 23.37,7.94 13.14,7.94 v12.32,7.11

### Text on the board
tValues: SRV 5V GND | GND RX2 TX2 3V3 | + BMS - | RES | EXT | - | IRQ | MIS | 1 | MOS | SCK | 1 | - | CSN | CE. | 1 | - | 3V3 | GND | 1 | 1 | GND / / D+ / / D- / / 5V | BREmote V1.1 Rx | UBAT | GND EMI CAT NC. | W1 . W2 | .NC AUX1 GND | GND SDA SCL 3V3
bValues: (c) Ludwig Bre 11/22 / BREmote V1.1 Rx PCB